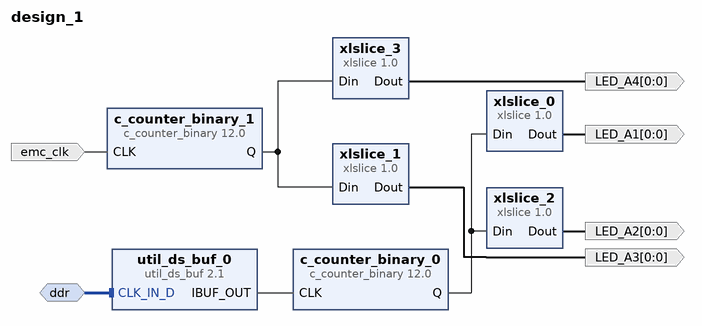
[diagram p0: block diagram of the top level]
# Vivado block design design_1, xc7a200tfbg484-2, Vivado 2018.2
create_bd_design design_1

create_bd_intf_port -mode Slave -vlnv xilinx.com:interface:diff_clock_rtl:1.0 ddr
create_bd_port -dir O -from 0 -to 0 LED_A1
create_bd_port -dir O -from 0 -to 0 LED_A2
create_bd_port -dir O -from 0 -to 0 LED_A4
create_bd_port -dir O -from 0 -to 0 LED_A3
create_bd_port -dir I emc_clk

create_bd_cell -type ip -vlnv xilinx.com:ip:c_counter_binary:12.0 c_counter_binary_0
set_property -dict {CONFIG.Output_Width 27} [get_bd_cells c_counter_binary_0]
create_bd_cell -type ip -vlnv xilinx.com:ip:xlslice:1.0 xlslice_0
set_property -dict {CONFIG.DIN_TO 25 CONFIG.DIN_FROM 25 CONFIG.DIN_WIDTH 27 CONFIG.DOUT_WIDTH 1} [get_bd_cells xlslice_0]
create_bd_cell -type ip -vlnv xilinx.com:ip:c_counter_binary:12.0 c_counter_binary_1
set_property -dict {CONFIG.Output_Width 27} [get_bd_cells c_counter_binary_1]
create_bd_cell -type ip -vlnv xilinx.com:ip:xlslice:1.0 xlslice_1
set_property -dict {CONFIG.DIN_TO 25 CONFIG.DIN_FROM 25 CONFIG.DIN_WIDTH 27 CONFIG.DOUT_WIDTH 1} [get_bd_cells xlslice_1]
create_bd_cell -type ip -vlnv xilinx.com:ip:xlslice:1.0 xlslice_2
set_property -dict {CONFIG.DIN_TO 26 CONFIG.DIN_FROM 26 CONFIG.DIN_WIDTH 27 CONFIG.DOUT_WIDTH 1} [get_bd_cells xlslice_2]
create_bd_cell -type ip -vlnv xilinx.com:ip:xlslice:1.0 xlslice_3
set_property -dict {CONFIG.DIN_TO 26 CONFIG.DIN_FROM 26 CONFIG.DIN_WIDTH 27 CONFIG.DOUT_WIDTH 1} [get_bd_cells xlslice_3]
create_bd_cell -type ip -vlnv xilinx.com:ip:util_ds_buf:2.1 util_ds_buf_0

# ---- connections ----

connect_bd_intf_net [get_bd_intf_ports ddr] [get_bd_intf_pins util_ds_buf_0/CLK_IN_D]
connect_bd_net [get_bd_pins c_counter_binary_0/Q] [get_bd_pins xlslice_0/Din] [get_bd_pins xlslice_2/Din]
connect_bd_net [get_bd_pins xlslice_0/Dout] [get_bd_ports LED_A1]
connect_bd_net [get_bd_pins c_counter_binary_1/Q] [get_bd_pins xlslice_1/Din] [get_bd_pins xlslice_3/Din]
connect_bd_net [get_bd_pins xlslice_2/Dout] [get_bd_ports LED_A2]
connect_bd_net [get_bd_pins xlslice_3/Dout] [get_bd_ports LED_A4]
connect_bd_net [get_bd_pins xlslice_1/Dout] [get_bd_ports LED_A3]
connect_bd_net [get_bd_ports emc_clk] [get_bd_pins c_counter_binary_1/CLK]
connect_bd_net [get_bd_pins util_ds_buf_0/IBUF_OUT] [get_bd_pins c_counter_binary_0/CLK]

validate_bd_design
save_bd_design
